# EAGLE design NORITAKE_ITRON_MN12832JC (EAGLE 9.5.2)
DESIGNER: NPoole
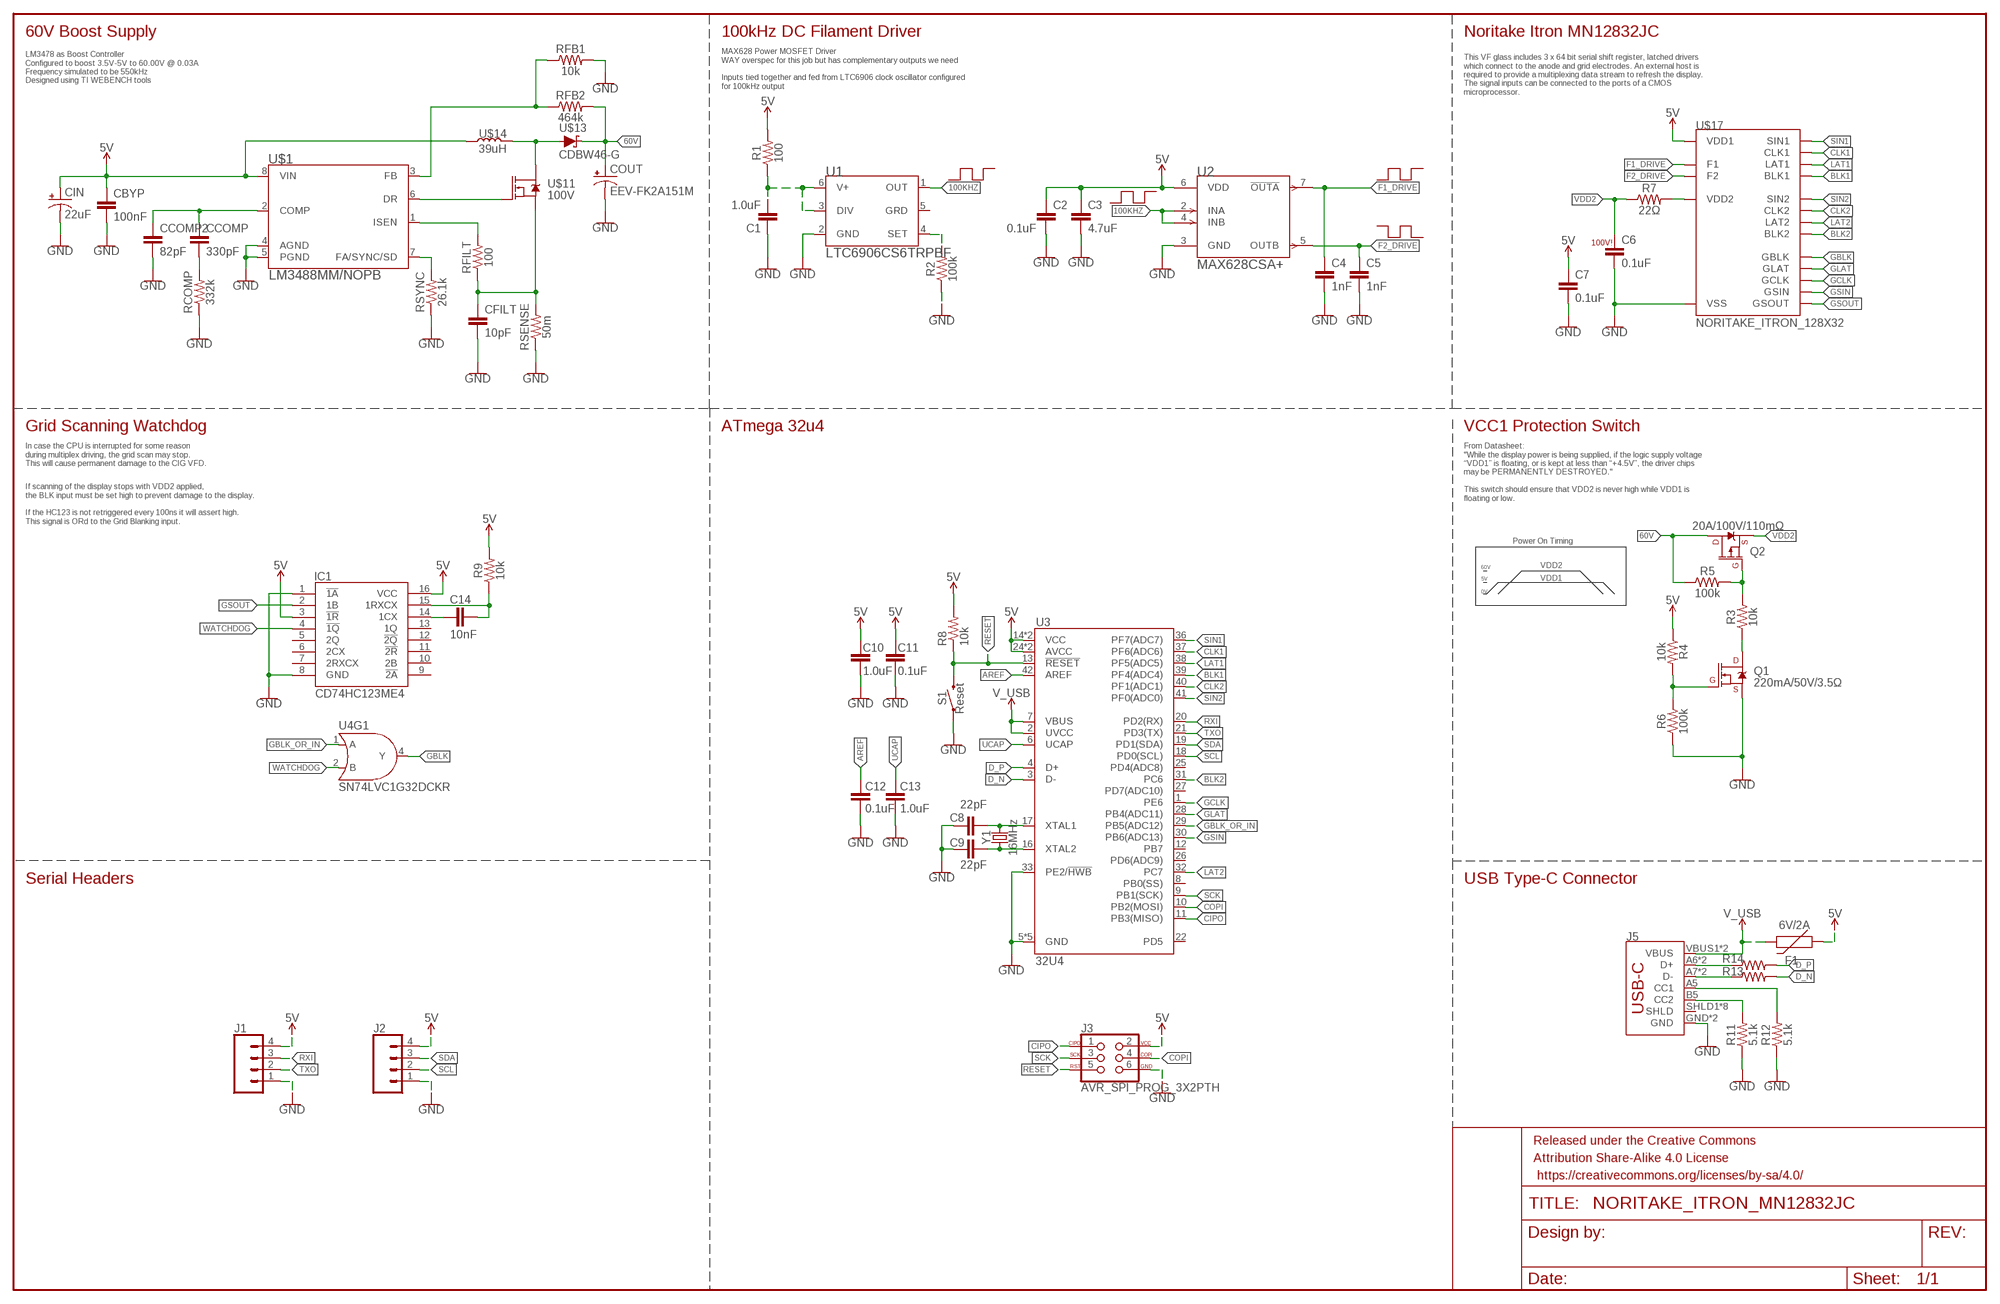
[diagram p0: schematic, sheet 1]

## Parts
C1  1.0uF  1.0UF-0603-16V-10%  [0603]
C2  0.1uF  0.1UF-0603-25V-(+80/-20%)  [0603]
C3  4.7uF  4.7UF-0603-35V-(20%)  [0603]
C4  1nF  1.0NF/1000PF-0603-50V-10%  [0603]
C5  1nF  1.0NF/1000PF-0603-50V-10%  [0603]
C6  0.1uF  0.1UF-0603-100V-10%  [0603]
C7  0.1uF  0.1UF-0603-25V-(+80/-20%)  [0603]
C8  22pF  22PF-0603-50V-5%  [0603]
C9  22pF  22PF-0603-50V-5%  [0603]
C10  1.0uF  1.0UF-0603-16V-10%  [0603]
C11  0.1uF  0.1UF-0603-25V-(+80/-20%)  [0603]
C12  0.1uF  0.1UF-0603-25V-(+80/-20%)  [0603]
C13  1.0uF  1.0UF-0603-16V-10%  [0603]
C14  10nF  10NF-0603-50V-10%  [0603]
CBYP  100nF  CL21C100JBANNNC  [0805]
CCOMP  330pF  CL21C331JBANNNC  [0805]
CCOMP2  82pF  CL21C820JBANNNC  [0805]
CFILT  10pF  GRM188R70J104KA01D  [0603]
CIN  22uF  EEE-FK1C220R  [SM_RADIAL_C]
COUT  EEV-FK2A151M  [SM_RADIAL_J16]
F1  6V/2A  PPTC_6V2A  [1210]
FRAME1  FRAME-LEDGERNO_FOOTPRINT  [DUMMY]
IC1  CD74HC123ME4  [SOIC127P600X175-16N]
J1  CONN_04PTH  [1X04]
J2  CONN_04PTH  [1X04]
J3  AVR_SPI_PROG_3X2PTH  [2X3]
J5  USB_C5  [USB-C-16P-5]
Q1  220mA/50V/3.5Ω  MOSFET-NCH-BSS138  [SOT23-3]
Q2  20A/100V/110mΩ  MOSFET_PCH-MCU20P10  [TO-252/DPAK]
R1  100  100OHM-0603-1/10W-1%  [0603]
R2  100k  100KOHM-0603-1/10W-1%  [0603]
R3  10k  10KOHM-0603-1/10W-1%  [0603]
R4  10k  10KOHM-0603-1/10W-1%  [0603]
R5  100k  100KOHM-0603-1/10W-1%  [0603]
R6  100k  100KOHM-0603-1/10W-1%  [0603]
R7  22Ω  22OHM-0603-1/10W-1%  [0603]
R8  10k  10KOHM-0603-1/10W-1%  [0603]
R9  10k  10KOHM-0603-1/10W-1%  [0603]
R11  5.1k  5.1KOHM5.1KOHM-0603-1/10W-1%  [0603]
R12  5.1k  5.1KOHM5.1KOHM-0603-1/10W-1%  [0603]
R13  22Ω  22OHM-0603-1/10W-1%  [0603]
R14  22Ω  22OHM-0603-1/10W-1%  [0603]
RCOMP  332k  CRCW0603332KFKEA  [0603]
RFB1  10k  CRCW060310K0FKEA  [0603]
RFB2  464k  RC0603FR-07464KL  [0603]
RFILT  100  CRCW0603100RFKEA  [0603]
RSENSE  50m  ERJ-L03KF50MV  [0603]
RSYNC  26.1k  RC0603FR-0726K1L  [0603]
S1  Reset  MOMENTARY-SWITCH-SPST-SMD-4.6X2.8MM  [TACTILE_SWITCH_SMD_4.6X2.8MM]
U1  LTC6906CS6TRPBF  [TSOT-23_6_ADI]
U2  MAX628CSA+  [21-0041B_8_MXM]
U3  32U4  ATMEGA32U4TQFP-44  [TQFP44]
U4  SN74LVC1G32DCKR  7432  [SOT353]
U$1  LM3488MM/NOPB  [MUA08A]
U$11  100V  BSC265N10LSF_G  [PG-TDSON-8]
U$13  CDBW46-G  [SOD-123]
U$14  39uH  NPI54C390KTRF  [IND_NPI54C]
U$17  NORITAKE_ITRON_128X32  [NORITAKE_ITRON_128X32]
Y1  16MHz  CRYSTAL-16MHZSMD-5X3.2  [CRYSTAL-SMD-5X3.2-4PAD]

## Nets
5V: C2.1 C3.1 C7.1 C10.2 C11.2 CBYP.1 CIN.1(+) F1.1 IC1.3(!1R) IC1.16(VCC) J1.4 J2.4 J3.2 R1.2 R4.1 R8.2 R9.2 U2.6(VDD) U3.14(VCC) U3.24(AVCC) U3.34(VCC) U3.44(AVCC) U$1.8(VIN) U$14.1 U$17.P$13(VDD1)
60V: COUT.1(+) Q2.2(D) R5.1 RFB2.2 U$13.1(C)
100KHZ: U1.1(OUT) U2.2(INA) U2.4(INB)
AREF: C12.2 U3.42(AREF)
BLK1: U3.39(PF4(ADC4)) U$17.P$4(BLK1)
BLK2: U3.31(PC6) U$17.P$23(BLK2)
CIPO: J3.1 U3.11(PB3(MISO))
CLK1: U3.37(PF6(ADC6)) U$17.P$6(CLK1)
CLK2: U3.40(PF1(ADC1)) U$17.P$21(CLK2)
COPI: J3.4 U3.10(PB2(MOSI))
D-_HV: J5.A7(D-) J5.B7(D-) R13.1
D_N: R13.2 U3.3(D-)
D_P: R14.2 U3.4(D+)
DP_HV: J5.A6(D+) J5.B6(D+) R14.1
F1_DRIVE: C4.1 U2.7(!OUTA) U$17.P$1(F1) U$17.P$2(F1) U$17.P$3(F1)
F2_DRIVE: C5.1 U2.5(OUTB) U$17.P$26(F2) U$17.P$27(F2) U$17.P$28(F2)
GBLK: U4.4(Y) U$17.P$14(GBLK)
GBLK_OR_IN: U3.29(PB5(ADC12)) U4.1(A)
GCLK: U3.1(PE6) U$17.P$16(GCLK)
GLAT: U3.28(PB4(ADC11)) U$17.P$15(GLAT)
GND: C1.1 C2.2 C3.2 C4.2 C5.2 C6.2 C7.2 C8.2 C9.2 C10.1 C11.1 C12.1 C13.1 CBYP.2 CCOMP2.2 CFILT.2 CIN.2(-) COUT.2(-) IC1.1(!1A) IC1.8(GND) J1.1 J2.1 J3.6 J5.GND J5.GND2(GND) Q1.2(S) R2.1 R6.1 R11.1 R12.1 RCOMP.1 RFB1.2 RSENSE.1 RSYNC.1 S1.1 S1.2 U1.2(GND) U2.3(GND) U3.5(GND) U3.15(GND) U3.23(GND) U3.33(PE2/!HWB) U3.35(GND) U3.43(GND) U$1.4(AGND) U$1.5(PGND) U$17.P$11(VSS) U$17.P$12(VSS)
GSIN: U3.30(PB6(ADC13)) U$17.P$17(GSIN)
GSOUT: IC1.2(1B) U$17.P$18(GSOUT)
LAT1: U3.38(PF5(ADC5)) U$17.P$5(LAT1)
LAT2: U3.32(PC7) U$17.P$22(LAT2)
N$1: RSYNC.2 U$1.7(FA/SYNC/SD)
N$2: CCOMP2.1 CCOMP.1 U$1.2(COMP)
N$3: RFILT.2 U$1.1(ISEN)
N$4: CCOMP.2 RCOMP.2
N$5: CFILT.1 RFILT.1 RSENSE.2 U$11.1(S) U$11.2(S) U$11.3(S)
N$6: U$11.5(D) U$11.6(D) U$11.7(D) U$11.8(D) U$11.9(D) U$13.2(A) U$14.2
N$7: RFB1.1 RFB2.1 U$1.3(FB)
N$8: U$1.6(DR) U$11.4(G)
N$9: C1.2 R1.1 U1.3(DIV) U1.6(V+)
N$10: R2.2 U1.4(SET)
N$11: R7.2 U$17.P$9(VDD2) U$17.P$10(VDD2)
N$12: Q1.1(G) R4.2 R6.2
N$13: Q1.3(D) R3.1
N$14: Q2.1(G) R3.2 R5.2
N$15: C9.1 U3.16(XTAL2) Y1.1
N$16: C8.1 U3.17(XTAL1) Y1.3
N$17: C14.2 IC1.14(1CX)
N$18: C14.1 IC1.15(1RXCX) R9.1
N$19: J5.A5(CC1) R12.2
N$20: J5.B5(CC2) R11.2
RESET: J3.5 R8.1 S1.3 S1.4 U3.13(!RESET)
RXI: J1.3 U3.20(PD2(RX))
SCK: J3.3 U3.9(PB1(SCK))
SCL: J2.2 U3.18(PD0(SCL))
SDA: J2.3 U3.19(PD1(SDA))
SIN1: U3.36(PF7(ADC7)) U$17.P$7(SIN1)
SIN2: U3.41(PF0(ADC0)) U$17.P$20(SIN2)
TXO: J1.2 U3.21(PD3(TX))
UCAP: C13.2 U3.6(UCAP)
V_USB: F1.2 J5.VBUS1(VBUS) J5.VBUS2(VBUS) U3.2(UVCC) U3.7(VBUS)
VDD2: C6.1 Q2.3(S) R7.1
WATCHDOG: IC1.4(!1Q) U4.2(B)
Unconnected: IC1.5(2Q) IC1.6(2CX) IC1.7(2RXCX) IC1.9(!2A) IC1.10(2B) IC1.11(!2R) IC1.12(!2Q) IC1.13(1Q) J5.SHLD1(SHLD) J5.SHLD2(SHLD) J5.SHLD3(SHLD) J5.SHLD4(SHLD) J5.SHLD5(SHLD) J5.SHLD6(SHLD) J5.SHLD7(SHLD) J5.SHLD8(SHLD) U1.5(GRD) U3.8(PB0(SS)) U3.12(PB7) U3.22(PD5) U3.25(PD4(ADC8)) U3.26(PD6(ADC9)) U3.27(PD7(ADC10)) U4.3(P$V-) U4.5(P$V+)

## Notes on the sheet
- 60V Boost Supply | 100kHz DC Filament Driver | Noritake Itron MN12832JC
- LM3478 as Boost Controller
  Configured to boost 3.5V-5V to 60.00V @ 0.03A
  Frequency simulated to be 550kHz
  Designed using TI WEBENCH tools
- MAX628 Power MOSFET Driver
  WAY overspec for this job but has complementary outputs we need
  
  Inputs tied together and fed from LTC6906 clock oscillator configured
  for 100kHz output
- This VF glass includes 3 x 64 bit serial shift register, latched drivers
  which connect to the anode and grid electrodes. An external host is
  required to provide a multiplexing data stream to refresh the display.
  The signal inputs can be connected to the ports of a CMOS
  microprocessor.
- 100V!
- Grid Scanning Watchdog | ATmega 32u4 | VCC1 Protection Switch
- In case the CPU is interrupted for some reason
  during multiplex driving, the grid scan may stop.
  This will cause permanent damage to the CIG VFD.
- From Datasheet:
  "While the display power is being supplied, if the logic supply voltage
  “VDD1” is floating, or is kept at less than “+4.5V”, the driver chips
  may be PERMANENTLY DESTROYED."
  
  This switch should ensure that VDD2 is never high while VDD1 is
  floating or low.
- If scanning of the display stops with VDD2 applied, 
  the BLK input must be set high to prevent damage to the display. 
  
  If the HC123 is not retriggered every 100ns it will assert high. 
  This signal is ORd to the Grid Blanking input.
- Power On Timing
- 60V | VDD2
- 5V | VDD1
- 0V
- Serial Headers | USB Type-C Connector

## Library data of the parts
C1 C10 C13 = SparkFun-Capacitors:1.0UF: 1µF ceramic capacitors A capacitor is a passive two-terminal electrical component used to store electrical energy temporarily in an electric field.; PROD_ID: CAP-00868
C2 C7 C11 C12 = SparkFun-Capacitors:0.1UF: 0.1µF ceramic capacitors A capacitor is a passive two-terminal electrical component used to store electrical energy temporarily in an electric field.; PROD_ID: CAP-00810
C3 = SparkFun-Capacitors:4.7UF: 4.7µF ceramic capacitors A capacitor is a passive two-terminal electrical component used to store electrical energy temporarily in an electric field.; PROD_ID: CAP-14106
C4 C5 = SparkFun-Capacitors:1.0NF/1000PF: 1nF/1,000pF ceramic capacitors A capacitor is a passive two-terminal electrical component used to store electrical energy temporarily in an electric field.; PROD_ID: CAP-07886
C6 = SparkFun-Capacitors:0.1UF: 0.1µF ceramic capacitors A capacitor is a passive two-terminal electrical component used to store electrical energy temporarily in an electric field.; PROD_ID: CAP-08390
C8 C9 = SparkFun-Capacitors:22PF: 22pF ceramic capacitors A capacitor is a passive two-terminal electrical component used to store electrical energy temporarily in an electric field.; PROD_ID: CAP-07876
C14 = SparkFun-Capacitors:10NF: 0.01uF/10nF/10,000pF ceramic capacitors A capacitor is a passive two-terminal electrical component used to store electrical energy temporarily in an electric field. CAP-09321; PROD_ID: CAP-00867
CBYP = exportWB2:CL21C100JBANNNC; MANUFACTURER_PART_NUMBER: CL21C100JBANNNC; VENDOR: Samsung ElectroMechanics
CCOMP = exportWB2:CL21C331JBANNNC; MANUFACTURER_PART_NUMBER: CL21C331JBANNNC; VENDOR: Samsung ElectroMechanics
CCOMP2 = exportWB2:CL21C820JBANNNC; MANUFACTURER_PART_NUMBER: CL21C820JBANNNC; VENDOR: Samsung ElectroMechanics
CFILT = exportWB2:GRM188R70J104KA01D; MANUFACTURER_PART_NUMBER: GRM188R70J104KA01D; VENDOR: MuRata
CIN = exportWB2:EEE-FK1C220R; MANUFACTURER_PART_NUMBER: EEEFK1C220R; VENDOR: Panasonic
COUT = exportWB2:EEV-FK2A151M; MANUFACTURER_PART_NUMBER: EEVFK2A151M; VENDOR: Panasonic
F1 = SparkFun-Fuses:PPTC: Resettable Fuse PPTC Resettable Fuse. Really a sort of resistor with a polymeric positive temperature coefficient whose resistance increases dramatically with an increase in temperature. When heated by the power passing through the resistance rises causing the current to be limited, protecting the circuit. This is achieved by the transition of the polymer from a crystalline to an amorphous state where the conductive carbon separates breaking the conductive pathways found in the cool crystalline structure. When a PPTC cools back down it resumes conducting letting the circuit turn back on. SparkFun Products: SparkFun RedBoard - Programmed with Arduino <https://www.sparkfun.com/products/12757> Pro Micro - 5V/16MHz <https://www.sparkfun.com/products/12640> Arduino Pro 328 - 5V/16MHz <https://www.sparkfun.com/products/10915> MP3 Trigger <https://www.sparkfun.com/products/13720>; PROD_ID: RES-14313
FRAME1 = SparkFun-Aesthetics:FRAME-LEDGER: Schematic Frame - Ledger Standard 11x14 US Ledger frame
IC1 = SamacSys_Parts:CD74HC123ME4: Monostable Multivibrator Hi-Spd CMOS Dual Retrig with Reset Source: Datasheet <https://www.ti.com/general/docs/suppproductinfo.tsp?distId=10&gotoUrl=https://www.ti.com/lit/gpn/cd74hc123>; DESCRIPTION: Monostable Multivibrator Hi-Spd CMOS Dual Retrig with Reset; HEIGHT: 1.75mm; MANUFACTURER_NAME: Texas Instruments; MANUFACTURER_PART_NUMBER: CD74HC123ME4; MOUSER_PART_NUMBER: 595-CD74HC123ME4; MOUSER_PRICE-STOCK: https://www.mouser.com/Search/Refine.aspx?Keyword=595-CD74HC123ME4
J1 J2 = SparkFun-Connectors:CONN_04: Multi connection point. Often used as Generic Header-pin footprint for 0.1 inch spaced/style header connections On any of the 0.1 inch spaced packages, you can populate with these: Break Away Headers - Straight <https://www.sparkfun.com/products/116> (PRT-00116) Break Away Male Headers - Right Angle <https://www.sparkfun.com/products/553> (PRT-00553) Female Headers <https://www.sparkfun.com/products/115> (PRT-00115) Break Away Headers - Machine Pin <https://www.sparkfun.com/products/117> (PRT-00117) Break Away Female Headers - Swiss Machine Pin <https://www.sparkfun.com/products/743> (PRT-00743) For SCREWTERMINALS and SPRING TERMINALS visit here: Screw Terimnals on SparkFun.com <https://www.sparkfun.com/search/results?term=Screw+Terminals> (5mm/3.5mm/2.54mm spacing) This device is also useful as a general connection point to wire up your design to another part of your project. Our various solder wires solder well into these plated through hole pads. Hook-Up Wire - Assortment (Stranded, 22 AWG) <https://www.sparkfun.com/products/11375> (PRT-11375) Hook-Up Wire - Assortment (Solid Core, 22 AWG) <https://www.sparkfun.com/products/11367> (PRT-11367) View the entire wire category on our website here <https://www.sparkfun.com/categories/141> Special notes: Molex polarized connector foot print use with SKU : PRT-08231 with associated crimp pins and housings. 1MM SMD Version SKU: PRT-10208; PROD_ID: CONN-09696
J3 = SparkFun-Connectors:AVR_SPI_PROG_3X2: AVR ISP 6 Pin This is the reduced ISP connector for AVR programming. Common on Arduino. This footprint will take up less PCB space and can be used with a 10-pin to 6-pin adapter such as SKU: BOB-08508 **Special note about "TEST_POINT" package. The stop mask is on the top side, so if you want your programming test points to be on the bottom of your board, make sure to place this package on the bottom side of the board. This also ensure that the orientation to program from the bottom side will be correct. SparkFun Products: SparkFun ISP Pogo Adapter <https://www.sparkfun.com/products/11591> - NS Tiny AVR Programmer <https://www.sparkfun.com/products/11801> -PTH
J5 = USBC:USB_C: USB Type C 16Pin Connector Super Speed pins not available on the 16-pin purely SMD connector so this part is best for USB 2.0 implementations. D1 and D2 are tied together enabling D+/- no matter which way the cable is plugged into the connector. The two channel configuration pins (CC1/2) are exposed. These are normally connected to ground via 5.1k resistors but can be reconfigured for high current/high power applications.
Q1 = SparkFun-DiscreteSemi:MOSFET-NCH: N-channel MOSFETs Voltage controlled devices that allow control of high current outputs. SparkFun Products: SparkFun OpenScale <https://www.sparkfun.com/products/13261> SparkFun Digital Sandbox <https://www.sparkfun.com/products/12651> SparkFun Monster Moto Shield <https://www.sparkfun.com/products/10182> SparkFun MOSFET Power Controller <https://www.sparkfun.com/products/11214>; PROD_ID: TRANS-00830
Q2 = SparkFun-DiscreteSemi:MOSFET_PCH: P-channel MOSFETs Voltage controlled devices that allow control of high current outputs. SparkFun Products: SparkFun ESP32 Thing <https://www.sparkfun.com/products/13907> SparkFun ESP8266 Thing <https://www.sparkfun.com/products/13231> SparkFun Pi Servo HAT V2 <https://www.sparkfun.com/products/15316> DMG2305UX-7 (20V/4.2A/SOT23-3); PROD_ID: TRAN-15964
R1 = SparkFun-Resistors:100OHM: 100Ω resistor A resistor is a passive two-terminal electrical component that implements electrical resistance as a circuit element. Resistors act to reduce current flow, and, at the same time, act to lower voltage levels within circuits. - Wikipedia; PROD_ID: RES-07863
R2 R5 R6 = SparkFun-Resistors:100KOHM: 100kΩ resistor A resistor is a passive two-terminal electrical component that implements electrical resistance as a circuit element. Resistors act to reduce current flow, and, at the same time, act to lower voltage levels within circuits. - Wikipedia; PROD_ID: RES-07828
R3 R4 R8 R9 = SparkFun-Resistors:10KOHM: 10kΩ resistor A resistor is a passive two-terminal electrical component that implements electrical resistance as a circuit element. Resistors act to reduce current flow, and, at the same time, act to lower voltage levels within circuits. - Wikipedia; PROD_ID: RES-00824
R7 R13 R14 = SparkFun-Resistors:22OHM: 22Ω resistor A resistor is a passive two-terminal electrical component that implements electrical resistance as a circuit element. Resistors act to reduce current flow, and, at the same time, act to lower voltage levels within circuits. - Wikipedia; PROD_ID: RES-08698
R11 R12 = SparkFun-Resistors:5.1KOHM; PROD_ID: RES-12083
RCOMP = exportWB2:CRCW0603332KFKEA; MANUFACTURER_PART_NUMBER: CRCW0603332KFKEA; VENDOR: VishayDale
RFB1 = exportWB2:CRCW060310K0FKEA; MANUFACTURER_PART_NUMBER: CRCW060310K0FKEA; VENDOR: VishayDale
RFB2 = exportWB2:RC0603FR-07464KL; MANUFACTURER_PART_NUMBER: RC0603FR07464KL; VENDOR: Yageo America
RFILT = exportWB2:CRCW0603100RFKEA; MANUFACTURER_PART_NUMBER: CRCW0603100RFKEA; VENDOR: VishayDale
RSENSE = exportWB2:ERJ-L03KF50MV; MANUFACTURER_PART_NUMBER: ERJL03KF50MV; VENDOR: Panasonic
RSYNC = exportWB2:RC0603FR-0726K1L; MANUFACTURER_PART_NUMBER: RC0603FR0726K1L; VENDOR: Yageo America
S1 = SparkFun-Switches:MOMENTARY-SWITCH-SPST: Momentary Switch (Pushbutton) - SPST Normally-open (NO) SPST momentary switches (buttons, pushbuttons). Variants PTH-12MM - 12mm square, through-hole Momentary Pushbutton Switch - 12mm Square <https://www.sparkfun.com/products/9190> (COM-09190) PTH-6.0MM, PTH-6.0MM-KIT - 6.0mm square, through-hole Mini Pushbutton Switch <https://www.sparkfun.com/products/97> (COM-00097) KIT package intended for soldering kit's - only one side of pads' copper is exposed. PTH-RIGHT-ANGLE-KIT - Right-angle, through-hole Right Angle Tactile Button <https://www.sparkfun.com/products/10791> - Used on SparkFun BigTime Watch Kit <https://www.sparkfun.com/products/11734> SMD-12MM - 12mm square, surface-mount Tactile Button - SMD (12mm) <https://www.sparkfun.com/products/12993> (COM-12993) Used on SparkFun PicoBoard <https://www.sparkfun.com/products/11888> SMD-4.5MM - 4.5mm Square Trackball Switch Used on SparkFun Blackberry Trackballer Breakout <https://www.sparkfun.com/products/13169> SMD-4.6MMX2.8MM - 4.60mm x 2.80mm, surface mount Used on SparkFun SAMD21 Mini Breakout <https://www.sparkfun.com/products/13664> SMD-5.2MM, SMD-5.2-REDUNDANT - 5.2mm square, surface-mount Mini Pushbutton Switch - SMD <https://www.sparkfun.com/products/8720> (COM-08720) Used on Arduino Pro Mini <https://www.sparkfun.com/products/11114> REDUNDANT package connects both switch circuits together SMD-6.0X3.5MM - 6.0 x 3.5mm, surface mount Momentary Reset Switch SMD <https://www.sparkfun.com/products/8229> (COM-08229) SMD-6.2MM-TALL - 6.2mm square, surface mount Tactile Button - SMD (6mm) <https://www.sparkfun.com/products/12992> Used on SparkFun Digital Sandbox <https://www.sparkfun.com/products/12651> SMD-RIGHT-ANGLE - Right-angle, surface mount Used on SparkFun Block for Intel® Edison - Arduino <https://www.sparkfun.com/products/13036>; PROD_ID: SWCH-13065
U1 = LTC6906:LTC6906CS6TRPBF; COPYRIGHT: Copyright (C) 2021 Ultra Librarian. All rights reserved.; DIGI-KEY_PART_NUMBER_1: LTC6906CS6#TRPBFCT-ND; DIGI-KEY_PART_NUMBER_2: LTC6906CS6#TRPBFDKR-ND; DIGI-KEY_PART_NUMBER_3: LTC6906CS6#TRPBFTR-ND; MANUFACTURER_PART_NUMBER: LTC6906CS6#TRPBF; MFR_NAME: Analog Devices Inc
U2 = MAX628:MAX628CSA+; COPYRIGHT: Copyright (C) 2021 Ultra Librarian. All rights reserved.; MANUFACTURER_PART_NUMBER: MAX628CSA+; MFR_NAME: Maxim Integrated Products
U3 = SparkFun-IC-Microcontroller:ATMEGA32U4: Atmel MCU, 32KByte Atmel 44-pin 8-bit Microcontroller with 32KBytes of ISP Flash and USB Controller Datasheet <http://cdn.sparkfun.com/datasheets/Dev/Arduino/Boards/ATMega32U4.pdf> SparkFun Products LilyPad Arduino USB - ATmega32U4 Board <https://www.sparkfun.com/products/12049> (DEV-12049) Pro Micro - 5V/16MHz <https://www.sparkfun.com/products/12640> (DEV-12640) Pro Micro - 3.3V/8MHz <https://www.sparkfun.com/products/12587> (DEV-12587) Fio v3 - ATmega32U4 <https://www.sparkfun.com/products/11520> (DEV-11520) Qduino Mini <https://www.sparkfun.com/products/13614> (DEV-13614) Makey Makey - Standard Kit <https://www.sparkfun.com/products/11511> (WIG-11511) Makey Makey Deluxe Kit <https://www.sparkfun.com/products/11519> (WIG-11519); PROD_ID: IC-11161
U4 = SparkFun-IC-Logic:74*32: Single OR gate IC POSITIVE-OR GATE 2-IN SC-70 SparkFun Products SparkFun Stepoko <https://www.sparkfun.com/products/13899> (ROB-13899) SparkFun LogicBlocks Kit <https://www.sparkfun.com/products/11006> (KIT-11006); PROD_ID: IC-10842
U$1 = exportWB2:LM3488MM/NOPB; MANUFACTURER_PART_NUMBER: LM3488MMNOPB; VENDOR: Texas Instruments
U$11 = exportWB2:BSC265N10LSF_G; MANUFACTURER_PART_NUMBER: BSC265N10LSF G; VENDOR: Infineon Technologies
U$13 = exportWB2:CDBW46-G; MANUFACTURER_PART_NUMBER: CDBW46G; VENDOR: Comchip Technology
U$14 = exportWB2:NPI54C390KTRF; MANUFACTURER_PART_NUMBER: NPI54C390KTRF; VENDOR: NIC Components
U$17 = VFDLib:NORITAKE_ITRON_128X32
Y1 = SparkFun-Clocks:CRYSTAL-16MHZ: 16MHz Crystal Digikey Example <http://www.digikey.com/product-search/en?keywords=535-9122-1-ND> Frequency: 16MHz Frequency Stability: ±50ppm Frequency Tolerance: ±20ppm Load Capacitance: 18pF SparkFun Products: Pro Micro -5V/16MHz <https://www.sparkfun.com/products/12640> SparkFun Serial Enabled LCD Kit <https://www.sparkfun.com/products/10097>; PROD_ID: XTAL-08218; SF_ID: COM-00094

## Board
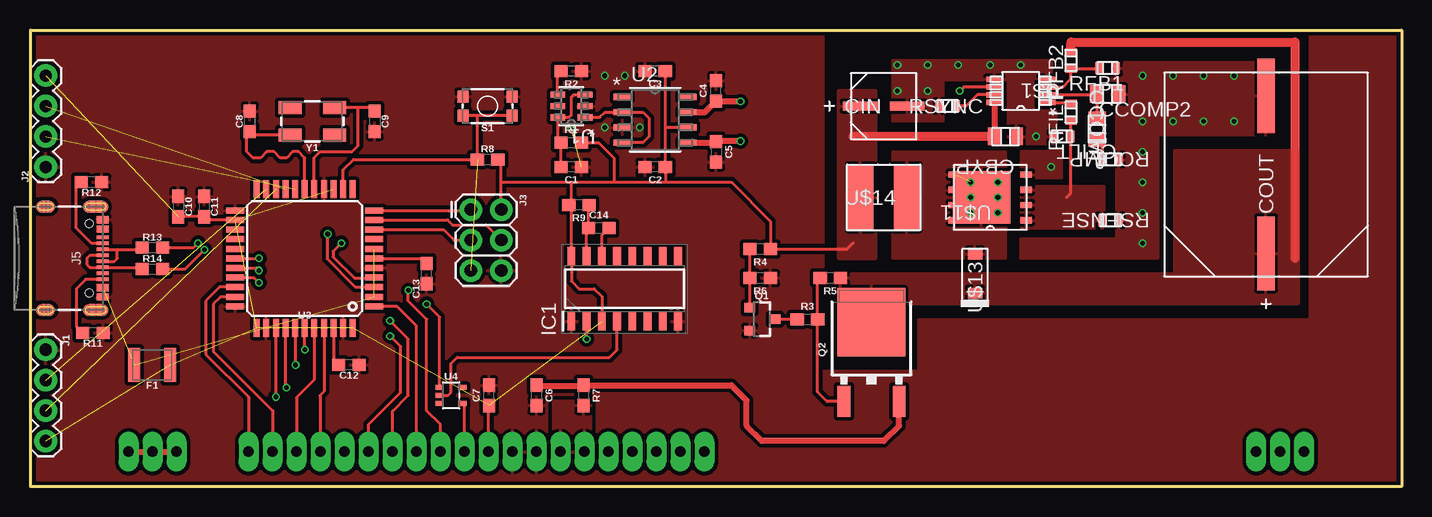
[diagram p1: board, top side]
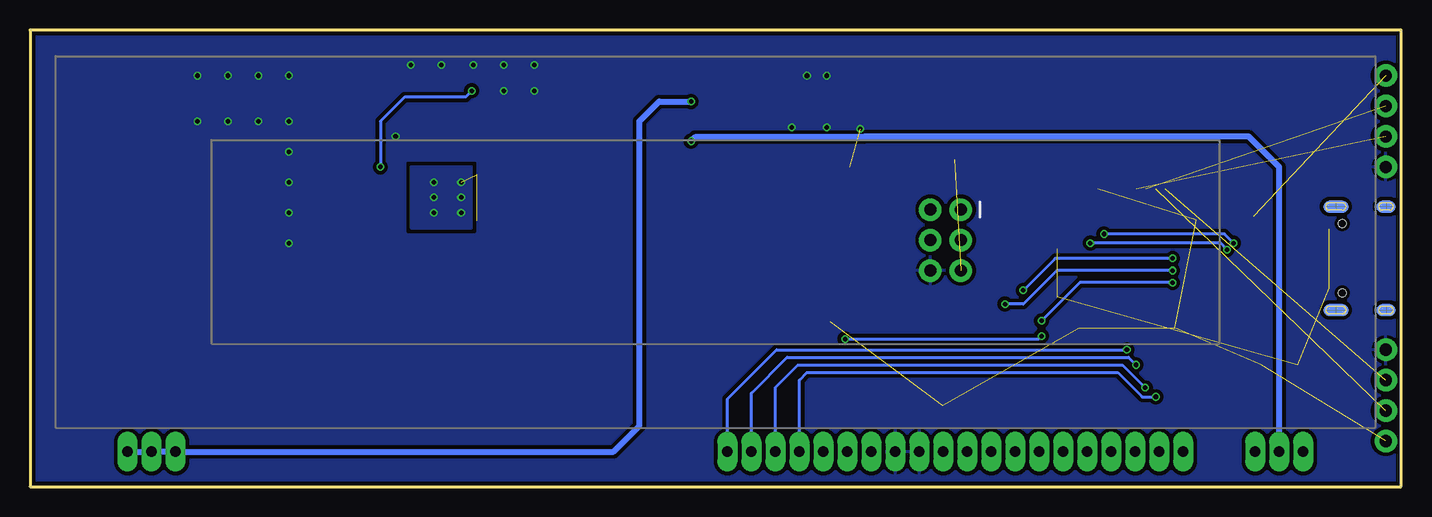
[diagram p2: board, bottom side, seen from below]

Size 114.3 x 38.1 mm. Coordinates in mm from the lower left corner, seen from the top.
Outline: 0,0 0,38.1 114.3,38.1 114.3,0 0,0
Copper layers (1*16): Top 0.035mm / dielectric 1.5mm / Bottom 0.035mm
Design rules "SparkFun-2-Layer-Minimum-JLCPCB": minimum track width 5mil, minimum drill 0.3mm, track to track 5mil, track to pad 5mil, pad to pad 5mil, via to via 5mil, smd to smd 5mil, copper to edge 7mil, drill to drill 7mil, minimum pad ring 5mil, minimum via ring 5mil, stop-mask expansion 4mil, vias tented up to drill 25mil, thermal gap 10mil

### Footprints (pad centres in the part's own frame; a part is rotated, then mirrored left to right if it is on the bottom)
0603 = smd 1.1 x 1: 1 -0.85,0; 2 0.85,0
0805 = smd 1.118 x 1.448: 1 -0.902,0; 2 0.902,0
0603' = smd 0.66 x 0.965: 1 -0.699,0; 2 0.699,0
SM_RADIAL_C = smd 2.87 x 0.762: 1 -1.968,0; 2 1.968,0
SM_RADIAL_J16 = smd 6.172 x 1.499: 1 -6.566,0; 2 6.566,0
1210 = smd 1 x 2.8: 1 -1.5,0; 2 1.5,0
SOIC127P600X175-16N = smd 1.525 x 0.65: 1 -2.712,4.445; 2 -2.712,3.175; 3 -2.712,1.905; 4 -2.712,0.635; 5 -2.712,-0.635; 6 -2.712,-1.905; 7 -2.712,-3.175; 8 -2.712,-4.445; 9 2.712,-4.445; 10 2.712,-3.175; 11 2.712,-1.905; 12 2.712,-0.635; 13 2.712,0.635; 14 2.712,1.905; 15 2.712,3.175; 16 2.712,4.445
1X04 = drill 1.016 pad 1.88: 1 0,0; 2 2.54,0; 3 5.08,0; 4 7.62,0
2X3 = drill 1.016 pad 1.88: 1 0,0; 2 0,2.54; 3 2.54,0; 4 2.54,2.54; 5 5.08,0; 6 5.08,2.54
USB-C-16P-5 = smd 0.3 x 1: A5 -1.25,-0.34; A6 -0.25,-0.34; A7 0.25,-0.34; A8 1.25,-0.34; B5 1.75,-0.34; B6 0.75,-0.34; B7 -0.75,-0.34; B8 -1.75,-0.34 | smd 0.6 x 1: GND -3.225,-0.34; GND2 3.225,-0.34; VBUS1 -2.45,-0.34; VBUS2 2.45,-0.34 | smd 1 x 2.1: SHLD1 -4.32,-0.915; SHLD2 4.32,-0.915 | smd 1 x 2.1 bottom: SHLD3 -4.32,-0.915; SHLD4 4.32,-0.915 | smd 1 x 1.6: SHLD5 -4.32,-5.095; SHLD8 4.32,-5.095 | smd 1 x 1.6 bottom: SHLD6 -4.32,-5.095; SHLD7 4.32,-5.095 | hole 0.65: -2.89,-1.445; 2.89,-1.445
SOT23-3 = smd 0.8 x 0.9: 1 -0.95,-1; 2 0.95,-1; 3 0,1.1
TO-252/DPAK = smd 1.06 x 2.6: 1 -2.3,-4.31; 3 2.3,-4.31 | smd 5.632 x 5.7: 2 0,2.288
TACTILE_SWITCH_SMD_4.6X2.8MM = smd 0.9 x 1: 1 -2.05,-0.8; 2 2.05,-0.8; 3 2.05,0.8; 4 -2.05,0.8
TSOT-23_6_ADI = smd 1.219 x 0.508: 1 -1.143,0.94; 2 -1.143,0; 3 -1.143,-0.94; 4 1.143,-0.94; 5 1.143,0; 6 1.143,0.94
21-0041B_8_MXM = smd 1.46 x 0.533: 1 -2.724,1.905; 2 -2.724,0.635; 3 -2.724,-0.635; 4 -2.724,-1.905; 5 2.724,-1.905; 6 2.724,-0.635; 7 2.724,0.635; 8 2.724,1.905
TQFP44 = smd 1.5 x 0.5: 1 -5.8,4; 2 -5.8,3.2; 3 -5.8,2.4; 4 -5.8,1.6; 5 -5.8,0.8; 6 -5.8,0; 7 -5.8,-0.8; 8 -5.8,-1.6; 9 -5.8,-2.4; 10 -5.8,-3.2; 11 -5.8,-4; 23 5.8,-4; 24 5.8,-3.2; 25 5.8,-2.4; 26 5.8,-1.6; 27 5.8,-0.8; 28 5.8,0; 29 5.8,0.8; 30 5.8,1.6; 31 5.8,2.4; 32 5.8,3.2; 33 5.8,4 | smd 0.5 x 1.5: 12 -4,-5.8; 13 -3.2,-5.8; 14 -2.4,-5.8; 15 -1.6,-5.8; 16 -0.8,-5.8; 17 0,-5.8; 18 0.8,-5.8; 19 1.6,-5.8; 20 2.4,-5.8; 21 3.2,-5.8; 22 4,-5.8; 34 4,5.8; 35 3.2,5.8; 36 2.4,5.8; 37 1.6,5.8; 38 0.8,5.8; 39 0,5.8; 40 -0.8,5.8; 41 -1.6,5.8; 42 -2.4,5.8; 43 -3.2,5.8; 44 -4,5.8
SOT353 = smd 0.42 x 0.7: 1 -0.65,-0.95; 2 0,-0.95; 3 0.65,-0.95; 4 0.65,0.95; 5 -0.65,0.95
MUA08A = smd 1.372 x 0.457: 1 -2.197,0.975; 2 -2.197,0.325; 3 -2.197,-0.325; 4 -2.197,-0.975; 5 2.197,-0.975; 6 2.197,-0.325; 7 2.197,0.325; 8 2.197,0.975
PG-TDSON-8 = smd 0.965 x 0.533: 1 -2.997,1.905; 2 -2.997,0.635; 3 -2.997,-0.635; 4 -2.997,-1.905; 5 2.997,-1.905; 6 2.997,-0.635; 7 2.997,0.635; 8 2.997,1.905 | smd 4.805 x 4.36: 9 0.725,0
SOD-123 = smd 0.915 x 1.22: 1 -1.637,0; 2 1.637,0
IND_NPI54C = smd 2.146 x 5.512: 1 -1.924,0; 2 1.924,0
NORITAKE_ITRON_128X32 = drill 0.889 pad 1.676 long: P$1 0,0; P$2 2,0; P$3 4,0; P$4 50,0; P$5 52,0; P$6 54,0; P$7 56,0; P$8 58,0; P$9 60,0; P$10 62,0; P$11 64,0; P$12 66,0; P$13 68,0; P$14 70,0; P$15 72,0; P$16 74,0; P$17 76,0; P$18 78,0; P$19 80,0; P$20 82,0; P$21 84,0; P$22 86,0; P$23 88,0; P$26 94,0; P$27 96,0; P$28 98,0
CRYSTAL-SMD-5X3.2-4PAD = smd 1.9 x 1.1: 1 -1.85,-1.15; 2 1.85,-1.15; 3 1.85,1.15; 4 -1.85,1.15

### Placement (x,y rotation side)
C1  45.09,26.67 180 top
C2  52.07,26.67 180 top
C3  52.07,34.67 180 top
C4  57.15,33.02 90 top
C5  57.15,27.94 270 top
C6  42.16,7.62 270 top
C7  38.23,7.62 90 top
C8  18.29,30.48 90 top
C9  28.7,30.48 270 top
C10  12.32,23.37 270 top
C11  14.48,23.37 270 top
C12  26.54,10.16 180 top
C13  33.02,17.78 90 top
C14  47.37,21.59 0 top
CBYP  81.28,29.21 0 top
CCOMP  88.9,29.84 270 top
CCOMP2  89.79,32.77 0 top
CFILT  10pF  [0603']  85.98,29.21 180 top
CIN  71.12,31.75 0 top
COUT  103,26.04 90 top
F1  10.16,10.16 180 top
FRAME1  0,0 0 top
IC1  49.53,16.51 90 top
J1  1.27,11.43 270 top
J2  1.27,26.67 90 top
J3  36.7,23.11 270 top
J5  6.35,19.05 270 top
Q1  60.96,13.97 270 top
Q2  70.1,11.43 0 top
R1  45.09,28.7 0 top
R2  45.09,34.67 180 top
R3  64.77,13.97 0 top
R4  60.83,19.81 180 top
R5  66.67,17.4 180 top
R6  60.83,17.4 180 top
R7  46.1,7.62 270 top
R8  38.1,27.3 0 top
R9  45.72,23.5 180 top
R11  5.21,12.83 180 top
R12  5.08,25.4 180 top
R13  10.16,19.94 0 top
R14  10.16,18.16 0 top
RCOMP  332k  [0603']  90.04,27.3 180 top
RFB1  10k  [0603']  89.79,34.92 0 top
RFB2  464k  [0603']  86.74,35.56 90 top
RFILT  100  [0603']  86.74,31.24 90 top
RSENSE  50m  [0603']  90.04,22.23 180 top
RSYNC  26.1k  [0603']  76.45,31.75 0 top
S1  38.1,31.75 180 top
U1  45.09,31.75 180 top
U2  52.07,30.61 0 top
U3  22.86,19.05 180 top
U4  35.05,7.62 270 top
U$1  82.55,33.02 180 top
U$11  80.01,24.13 180 top
U$13  78.74,17.78 90 top
U$14  71.12,24.13 0 top
U$17  106.17,2.92 0 bottom
Y1  23.5,30.48 180 top

### Tracks (layer width: path | path; a pad name or v marks a point on that pad's centre or on a via)
5V  (8 unrouted)
  Top 0.254: 68.58,20.32 68.07,19.81 R4.1 61.68,22.14 58.42,25.4 52.96,25.4 | 52.92,29.97 C2.1 52.92,25.44 52.96,25.4 | 52.92,29.97 C3.1 | U2.6 52.92,29.97 | J3.2 39.24,25.4 | 39.24,25.4 39.24,27.01 R8.2 | 39.24,25.4 45.09,25.4 | 45.09,25.4 48.64,25.4 | 48.64,25.4 52.96,25.4 | R1.2 47.37,28.7 48.64,27.43 48.64,25.4 | 45.09,25.4 45.09,23.71 R9.2 45.09,23.28 IC1.16 45.09,17.14 45.72,16.51 46.99,16.51 47.62,15.88 IC1.3 | U$17.P$13 38.17,6.71 C7.1 | U3.24 14.75,22.25 C11.2 C10.2
  Top 0.508: U$1.8 80.35,29.21 CBYP.1
  Top 0.762: CBYP.1 68.58,29.21
  pour Top (isolate 0.305): 70.48,19.05 70.48,33.02 67.31,33.02 67.31,19.05
60V
  Top 0.762: RFB2.2 86.74,37.08 105.41,37.08 105.41,19.05
  pour Top (isolate 0.305): 67.31,17.78 95.38,17.78 95.38,28.07 105.66,28.07 105.66,15.24 67.31,15.24
100KHZ
  Top 0.254: U1.1 47.45,30.81 47.88,31.24 U2.2 51.05,31.24 51.56,30.73 51.56,29.21 51.05,28.7 U2.4
AREF
  Top 0.254: U3.42 25.26,10.59 C12.2
BLK1  (via drill 0.38)
  Top 0.254: v22.86,11.43 U3.39
  Bottom 0.254: U$17.P$4 56.17,7.33 52.07,11.43 v22.86,11.43
BLK2
  Top 0.254: U3.31 15.76,16.65 14.61,15.49 14.61,11.05 18.17,7.48 U$17.P$23
CIPO
  Top 0.254: U3.11 36.64,23.05 J3.1
CLK1  (via drill 0.38)
  Top 0.254: v21.34,8.26 21.26,8.33 U3.37
  Bottom 0.254: U$17.P$6 52.17,8.28 50.29,10.16 23.24,10.16 v21.34,8.26
CLK2
  Top 0.254: U3.40 23.66,8.93 22.17,7.44 U$17.P$21
COPI
  Top 0.254: U3.10 34.77,22.25 35.18,21.84 37.97,21.84 J3.4
D-_HV
  Top 0.254: J5.B7 7.24,19.8 | 7.24,19.8 9.17,19.8 R13.1 | J5.A7 6.99,18.8 7.24,19.05 7.24,19.8
D_N  (via drill 0.38)
  Top 0.254: v13.97,20.32 13.59,19.94 R13.2 | 27.08,16.65 27.09,16.64 | v24.77,21.08 24.71,21.03 24.71,19.02 26.95,16.79 27.08,16.65 | 27.08,16.65 U3.3
  Bottom 0.254: v13.97,20.32 14.73,21.08 v24.77,21.08
D_P  (via drill 0.38)
  Top 0.254: v14.51,19.78 12.89,18.16 R14.2 | v25.91,20.32 25.22,19.63 25.22,19.18 27,17.39 28.6,17.39 U3.4
  Bottom 0.254: v14.51,19.78 15.05,20.32 v25.91,20.32
DP_HV
  Top 0.254: R14.1 9.17,18.3 J5.B6 6,18.29 4.95,18.29 4.7,18.54 4.7,19.05 4.95,19.3 J5.A6
F1_DRIVE  (via drill 0.38)
  Top 0.508: U2.7 56.22,31.24 C4.1 57.19,32.13 v59.18,32.13
  Bottom 0.508: U$17.P$1 U$17.P$2 U$17.P$3 65.66,2.92 63.5,5.08 63.5,30.48 61.85,32.13 v59.18,32.13
F2_DRIVE  (via drill 0.38)
  Top 0.254: 57.06,28.7 C5.1
  Top 0.508: v59.18,28.83 57.19,28.83 57.06,28.7 U2.5 | U$17.P$28 U$17.P$27 U$17.P$26
  Bottom 0.508: U$17.P$27 10.17,26.68 12.7,29.21 44.73,29.21 44.8,29.15 58.86,29.15 v59.18,28.83
GBLK
  Top 0.254: U$17.P$14 36.17,6.8 U4.4
GBLK_OR_IN  (via drill 0.38)
  Top 0.254: U4.1 34.1,14.16 v33.02,15.24 | U3.29 18.83,18.25 v19.05,18.03
  Bottom 0.254: v19.05,18.03 28.7,18.03 31.5,15.24 v33.02,15.24
GCLK
  Top 0.254: U$17.P$16 32.17,13.42 30.54,15.05 U3.1
GLAT  (via drill 0.38)
  Top 0.254: U$17.P$15 34.17,5.2 33.02,6.35 33.02,13.97 31.5,15.49 v31.5,16.38 | U3.28 v19.05,19.05
  Bottom 0.254: v19.05,19.05 28.83,19.05 v31.5,16.38
GND  (via drill 0.38)  (1 unrouted)
  other vias: 72.26,35.18 72.26,33.02 74.8,35.18 74.8,33.02 77.34,35.18 80.01,35.18 82.55,35.18 83.82,29.21 92.71,34.29 95.25,34.29 97.79,34.29 100.33,34.29 100.33,30.48 97.79,30.48 95.25,30.48 92.71,30.48 92.71,27.94 92.71,25.4 92.71,22.86 92.71,20.32 45.09,29.84 47.88,29.97 50.8,29.97 47.88,34.29 49.53,34.29
  pour Top (isolate 0.305): 71.88,30.48 71.88,35.56 85.09,35.56 85.09,34.04 83.57,34.04 83.57,31.37 85.47,31.37 85.47,28.57 81.53,28.57 81.53,33.91 76.07,33.91 76.07,30.48
  pour Top (isolate 0.305): 90.55,20.7 90.55,32.13 90.17,32.13 90.17,35.43 103.5,35.43 103.5,29.34 93.98,29.34 93.98,19.05 82.55,19.05 82.55,20.7
  pour Top (isolate 0.305, rank 2): 0,38.1 66.04,38.1 66.04,9.65 74.04,9.65 74.04,13.97 106.68,13.97 106.68,38.1 114.3,38.1 114.3,0 0,0
  pour Bottom (isolate 0.305, rank 2): 0,38.1 114.3,38.1 114.3,0 0,0
GSIN  (via drill 0.38)
  Top 0.254: U$17.P$17 30.17,6.3 31.5,7.62 31.5,12.32 v29.97,13.84 | U3.30 18.62,17.45 v19.05,17.02
  Bottom 0.254: v19.05,17.02 26.8,17.02 v29.97,13.84
GSOUT  (via drill 0.38)
  Top 0.254: U$17.P$18 28.17,5.18 30.86,7.87 30.86,11.68 v29.97,12.57 | v46.35,12.32 IC1.2
  Bottom 0.254: v46.35,12.32 30.23,12.32 v29.97,12.57
LAT1  (via drill 0.38)
  Top 0.254: v22.1,10.16 22.1,13.21 U3.38
  Bottom 0.254: U$17.P$5 54.17,7.8 51.18,10.79 22.73,10.79 v22.1,10.16
LAT2
  Top 0.254: U3.32 15.85,15.85 15.24,15.24 15.24,11.3 20.19,6.35 20.19,2.94 U$17.P$22
N$1
  Top 0.254: U$1.7 78.92,32.7 77.98,31.75 RSYNC.2
N$2
  Top 0.254: U$1.2 88.82,32.7 CCOMP2.1 88.89,30.76 CCOMP.1
N$3
  Top 0.254: U$1.1 86.64,32.05 RFILT.2
N$4
  Top 0.254: RCOMP.2 89.34,28.5 CCOMP.2
N$5
  Top 0.254: RFILT.1 86.68,30.48 CFILT.1 86.68,24.45 86.36,24.13
  pour Top (isolate 0.305): 82.55,21.59 89.53,21.59 89.53,25.02 82.55,25.02
N$6  (via drill 0.38)  (4 unrouted)
  other vias: 78.36,25.4 78.36,24.13 78.36,22.86 80.64,25.4 80.64,24.13 80.64,22.86
  pour Top (isolate 0.305): 81.28,27.94 81.28,19.05 71.88,19.05 71.88,27.94
  pour Bottom (isolate 0.305): 77.47,26.67 82.55,26.67 82.55,21.59 77.47,21.59
N$7
  Top 0.254: U$1.3 86.05,33.34 86.74,34.04 RFB2.1 89.03,34.86 RFB1.1
N$8  (via drill 0.38)
  Top 0.254: U$1.6 77.8,33.34 v77.47,33.02
  Bottom 0.254: v77.47,33.02 77.98,32.51 83.06,32.51 85.09,30.48 v85.09,26.67
  pour Top (isolate 0.305): 85.98,25.78 85.98,27.94 82.55,27.94 82.55,25.78
N$9
  Top 0.254: C1.2 R1.1 43.94,29 U1.6 44.91,30.81 45.09,30.99 45.09,32.51 45.26,32.69 U1.3
N$10
  Top 0.254: U1.4 43.94,34.38 R2.2
N$11
  Top 0.508: 46.17,6.7 R7.2
  pour Top (isolate 0.305): 45.97,7.11 43.56,7.11 43.56,2.92 46.74,2.92 46.74,7.11
N$12
  Top 0.254: Q1.1 59.96,17.38 R6.2 R4.2
N$13
  Top 0.254: R3.1 Q1.3
N$14
  Top 0.254: Q2.1 66.41,7.12 65.62,7.91 R3.2 65.62,17.19 R5.2
N$15
  Top 0.254: C9.1 28.4,31.63 27.3,31.63 | 27.3,31.63 Y1.1 | U3.16 23.66,27.47 24.13,27.94 26.8,27.94 27.3,28.45 27.3,31.63
N$16
  Top 0.254: Y1.3 18.59,29.33 C8.1 18.03,29.38 18.03,27.94 18.54,27.43 19.18,27.43 19.68,27.94 20.32,27.94 20.83,27.43 21.34,27.43 21.84,27.94 22.35,27.94 22.86,27.43 U3.17
N$17
  Top 0.254: IC1.14 47.62,20.99 C14.2
N$18
  Top 0.254: IC1.15 46.35,21.42 C14.1 46.52,23.45 R9.1
N$19
  Top 0.254: J5.A5 5.1,20.3 3.81,21.59 3.81,24.98 R12.2
N$20
  Top 0.254: J5.B5 4.6,17.3 3.81,16.51 3.81,13.37 R11.2
RESET  (1 unrouted)
  Top 0.254: S1.4 37.21,30.95 | 37.21,30.95 S1.3 | 37.21,30.95 37.25,30.91 R8.1 26.92,27.3 26.06,26.44 U3.13
RXI  (1 unrouted)
SCK
  Top 0.254: U3.9 34.43,21.45 35.31,20.57 J3.3
SCL  (1 unrouted)
SDA  (1 unrouted)
SIN1  (via drill 0.38)
  Top 0.254: v20.45,7.49 20.46,7.51 U3.36
  Bottom 0.254: U$17.P$7 50.17,8.88 49.53,9.53 23.62,9.53 21.59,7.49 v20.45,7.49
SIN2
  Top 0.254: U3.41 24.46,7.95 24.13,7.62 24.13,2.96 U$17.P$20
TXO  (1 unrouted)
UCAP
  Top 0.254: U3.6 32.6,19.05 C13.2
V_USB  (4 unrouted)
VDD2
  Top 0.508: C6.1 42.25,8.38 46.01,8.38 R7.1 58.42,8.47 59.69,7.2 59.69,5.08 60.96,3.81 71.12,3.81 72.4,5.09 Q2.3
WATCHDOG
  Top 0.254: U4.2 34.8,7.62 35.05,7.87 35.05,10.29 35.56,10.79 48.26,10.79 48.9,11.43 IC1.4